# EAGLE design SNAC USB3-mini (EAGLE 7.7.0)
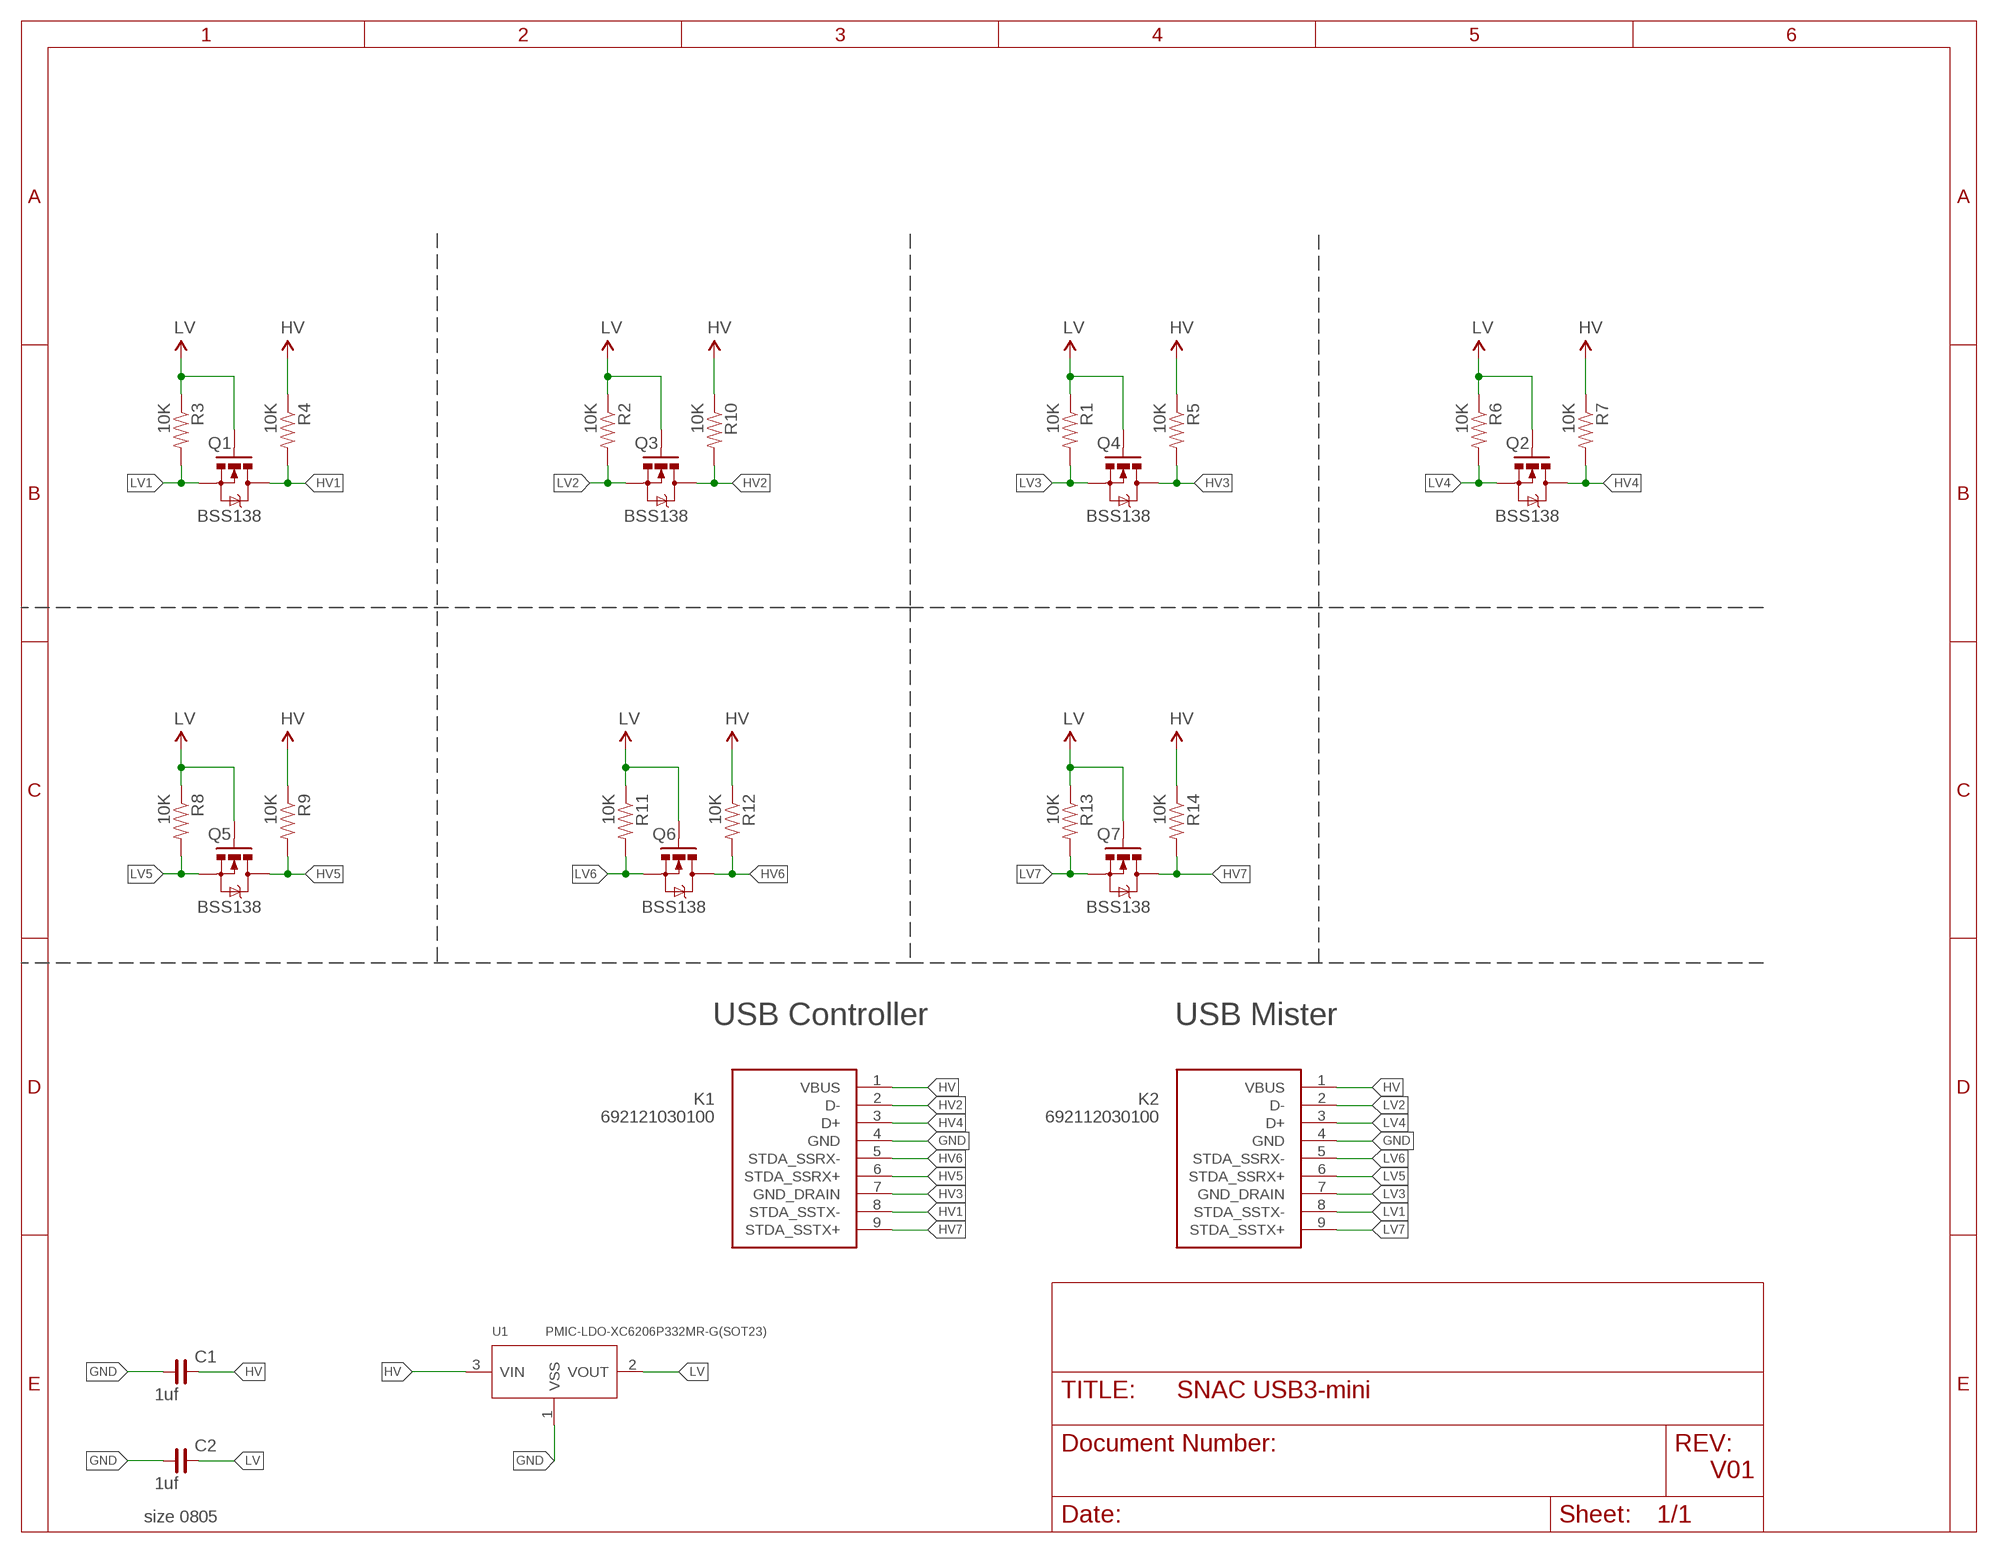
[diagram p0: schematic, sheet 1]

## Parts
C1  1uf  C_0805  [C0805]
C2  1uf  C_0805  [C0805]
K1  692121030100  [692121030100]
K2  692112030100  [692112030100]
Q1  BSS138  MOSFET-NCHANNELSMD  [SOT23-3]
Q2  BSS138  MOSFET-NCHANNELSMD  [SOT23-3]
Q3  BSS138  MOSFET-NCHANNELSMD  [SOT23-3]
Q4  BSS138  MOSFET-NCHANNELSMD  [SOT23-3]
Q5  BSS138  MOSFET-NCHANNELSMD  [SOT23-3]
Q6  BSS138  MOSFET-NCHANNELSMD  [SOT23-3]
Q7  BSS138  MOSFET-NCHANNELSMD  [SOT23-3]
R1  10K  RESISTOR0603-RES  [0603-RES]
R2  10K  RESISTOR0603-RES  [0603-RES]
R3  10K  RESISTOR0603-RES  [0603-RES]
R4  10K  RESISTOR0603-RES  [0603-RES]
R5  10K  RESISTOR0603-RES  [0603-RES]
R6  10K  RESISTOR0603-RES  [0603-RES]
R7  10K  RESISTOR0603-RES  [0603-RES]
R8  10K  RESISTOR0603-RES  [0603-RES]
R9  10K  RESISTOR0603-RES  [0603-RES]
R10  10K  RESISTOR0603-RES  [0603-RES]
R11  10K  RESISTOR0603-RES  [0603-RES]
R12  10K  RESISTOR0603-RES  [0603-RES]
R13  10K  RESISTOR0603-RES  [0603-RES]
R14  10K  RESISTOR0603-RES  [0603-RES]
U1  PMIC-LDO-XC6206P332MR-G(SOT23)  [SOT-23]

## Nets
GND: C1.1 C2.1 K1.4(GND) K2.4(GND) U1.1(VSS)
HV: C1.2 K1.1(VBUS) K2.1(VBUS) R4.1 R5.1 R7.1 R9.1 R10.1 R12.1 R14.1 U1.3(VIN)
HV1: K1.8(STDA_SSTX-) Q1.3(D) R4.2
HV2: K1.2(D-) Q3.3(D) R10.2
HV3: K1.7(GND_DRAIN) Q4.3(D) R5.2
HV4: K1.3(D+) Q2.3(D) R7.2
HV5: K1.6(STDA_SSRX+) Q5.3(D) R9.2
HV6: K1.5(STDA_SSRX-) Q6.3(D) R12.2
HV7: K1.9(STDA_SSTX+) Q7.3(D) R14.2
LV: C2.2 Q1.1(G) Q2.1(G) Q3.1(G) Q4.1(G) Q5.1(G) Q6.1(G) Q7.1(G) R1.1 R2.1 R3.1 R6.1 R8.1 R11.1 R13.1 U1.2(VOUT)
LV1: K2.8(STDA_SSTX-) Q1.2(S) R3.2
LV2: K2.2(D-) Q3.2(S) R2.2
LV3: K2.7(GND_DRAIN) Q4.2(S) R1.2
LV4: K2.3(D+) Q2.2(S) R6.2
LV5: K2.6(STDA_SSRX+) Q5.2(S) R8.2
LV6: K2.5(STDA_SSRX-) Q6.2(S) R11.2
LV7: K2.9(STDA_SSTX+) Q7.2(S) R13.2

## Notes on the sheet
- USB Controller | USB Mister
- V01
- size 0805

## Library data of the parts
C1 C2 = rc-master-smd:C_: NON-POLARIZED CAP
K1 = Wuerth_Elektronik_eiCan_Communication_Connectors_STENCIL:692121030100: WR-COM USB 3.0 HORIZONTAL TYPE A
K2 = Wuerth_Elektronik_eiCan_Communication_Connectors_STENCIL:692112030100: WR-COM USB 3.0 SMT PLUG WITH CLIPTYPE A
Q1-Q7 = SparkFun:MOSFET-NCHANNEL
R1-R14 = SparkFun:RESISTOR: Resistor Basic schematic elements and footprints for 0603, 1206, and PTH resistors.
U1 = PMIC-LDO-XC6206P332MR-G_SOT23_:PMIC-LDO-XC6206P332MR-G(SOT23): 310030099; AVAILABILITY: Unavailable; DESCRIPTION: SMD PMIC; LDO; Vin 6V; 3.3V; 200mA; Without En; 1-Ch; MF: Torex; MP: XC6206P332MR-G; PACKAGE: SOT-23-3 Torex; PRICE: None

## Board
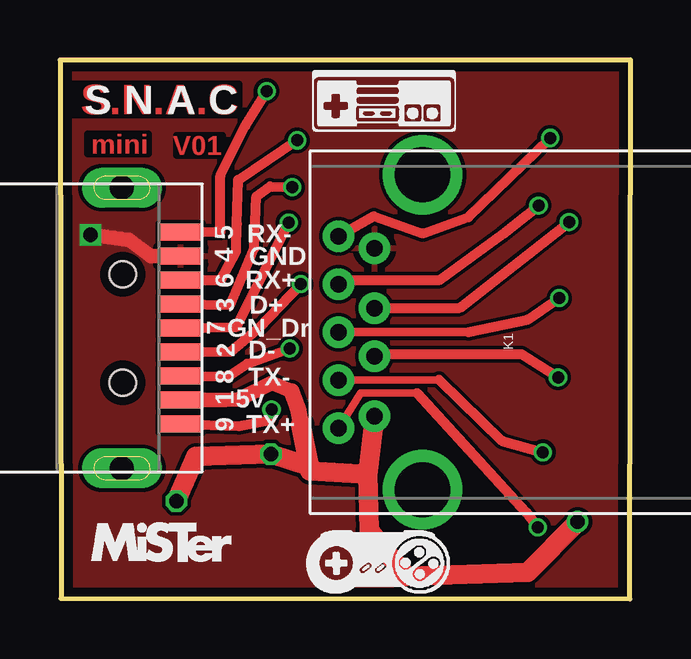
[diagram p1: board, top side]
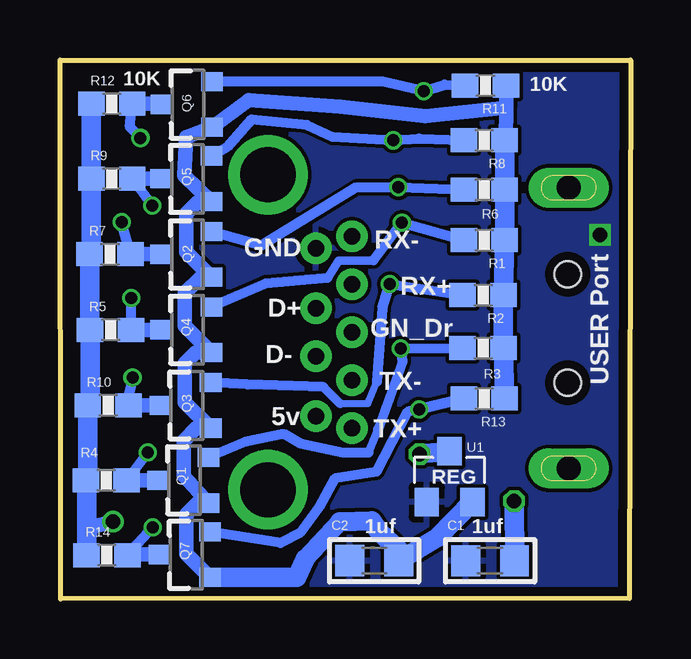
[diagram p2: board, bottom side, seen from below]

Size 23.77 x 22.48 mm. Coordinates in mm from the lower left corner, seen from the top.
Outline: 0.05,0.03 23.75,0 23.77,22.48 0,22.48 0.05,0.03
Copper layers (1*16): Top 0.035559375mm / dielectric 1.6mm / Bottom 0.035559375mm
Design rules "oshpark-2layer": minimum track width 6mil, minimum drill 10mil, track to track 6mil, track to pad 6mil, pad to pad 6mil, via to via 6mil, smd to smd 6mil, copper to edge 15mil, drill to drill 6mil, minimum pad ring 5mil, minimum via ring 5mil, stop-mask expansion 2.5mil, vias tented up to drill 0mil, thermal gap 10mil
Holes 1.1 mm at 2.62,13.54 2.62,9.02

### Footprints (pad centres in the part's own frame; a part is rotated, then mirrored left to right if it is on the bottom)
C0805 = smd 1.2 x 1.3: 1 -1.016,0; 2 1.016,0
692121030100 = drill 0.7 pad 1.3: 1 3.5,1.5; 2 1,1.5; 3 -1,1.5; 4 -3.5,1.5; 5 -4,0; 6 -2,0; 7 0,0; 8 2,0; 9 4,0 | drill 2.3 pad 3.3: Z1 -6.57,3.5; Z2 6.57,3.5
692112030100 = smd 0.7 x 1.8: 1 -3,0; 2 -1,0; 3 1,0; 4 3,0; 5 4,0; 6 2,0; 7 0,0; 8 -2,0; 9 -4,0 | drill 1 pad 1.676 long: Z1 5.85,2.45; Z2 -5.85,2.45
SOT23-3 = smd 0.8 x 0.9: 1 -0.95,-1; 2 0.95,-1; 3 0,1.1
0603-RES = smd 1.1 x 1: 1 -0.85,0; 2 0.85,0
SOT-23 = smd 1.016 x 1.2: 1 -0.95,-1.06; 2 0.95,-1.06; 3 0,1.06

### Placement (x,y rotation side)
C1  5.85,1.6 0 bottom
C2  10.68,1.6 0 bottom
K1  11.61,11.13 270 top
K2  5.03,11.3 90 top
Q1  18.59,4.95 90 bottom
Q2  18.47,14.38 90 bottom
Q3  18.49,8.08 90 bottom
Q4  18.47,11.23 90 bottom
Q5  18.47,17.53 90 bottom
Q6  18.44,20.62 90 bottom
Q7  18.52,1.85 90 bottom
R1  6.1,14.96 180 bottom
R2  6.15,12.67 180 bottom
R3  6.15,10.46 180 bottom
R4  21.85,4.95 0 bottom
R5  21.67,11.23 0 bottom
R6  6.1,17.07 180 bottom
R7  21.69,14.38 0 bottom
R8  6.1,19.13 180 bottom
R9  21.62,17.53 0 bottom
R10  21.77,8.08 0 bottom
R11  6.05,21.41 180 bottom
R12  21.62,20.65 0 bottom
R13  6.1,8.36 180 bottom
R14  21.82,1.83 0 bottom
U1  7.54,5.11 0 bottom

### Tracks (layer width: path | path; a pad name or v marks a point on that pad's centre or on a via)
GND  (via drill 0.6)
  Top 0.61: K2.4 3.78,14.3 2.9,14.96 v1.27,15.19
  Bottom 0.61: v1.27,15.19 1.27,15.16
  pour Top: -0.05,22.53 23.57,22.48 23.77,-0.05 0.05,0.03
  pour Bottom: -0.03,22.45 23.65,22.5 23.77,-0.05 0.03,0.03
HV  (via drill 0.6)
  Top 0.61: K2.1 6.88,8.31 7.42,8.33 8.81,9.02 9.64,8.67
  Top 0.66: 9.64,8.67 9.91,7.95 10.03,7.29
  Top 0.813: v21.56,3.23 19.48,1.12 14.43,0.94 12.88,2.87 12.81,5.2 | K1.1 12.81,5.2 | 12.81,5.2 10.41,5.33 10.38,5.54 | 10.03,7.29 10.38,5.54 | 10.38,5.54 v8.79,6.05 5.66,5.94 v4.85,4.09
  Bottom 0.61: 22.67,4.92 R4.1 | R14.1 22.68,1.82 22.48,3.01 v21.56,3.23
  Bottom 0.813: R14.1 22.67,4.92 | R4.1 22.62,5.03 R10.1 22.52,8.18 R5.1 22.54,11.25 R7.1 22.47,14.45 R9.1 R12.1 | C1.2 v4.85,4.09 | v8.79,6.05 U1.3
HV1  (via drill 0.5)
  Top 0.305: 11.74,9.14 15.8,9.14
  Top 0.406: K1.8 11.74,9.14 | 15.8,9.14 18.42,6.6 v20.12,6.12
  Bottom 0.406: R4.2 v20.12,6.12
  Bottom 0.61: Q1.3 R4.2
HV2  (via drill 0.5)
  Top 0.406: K1.2 13.19,10.21 19.23,10.21 v20.75,9.25
  Bottom 0.406: v20.75,9.25 20.92,8.52 R10.2
  Bottom 0.61: Q3.3 R10.2
HV3  (via drill 0.5)
  Top 0.356: K1.7 17.02,11.13
  Top 0.406: 17.02,11.13 19.51,11.66 v20.8,12.55
  Bottom 0.406: v20.8,12.55 20.82,12.46 R5.2
  Bottom 0.61: R5.2 Q4.3
HV4  (via drill 0.5)
  Top 0.406: K1.3 16.65,12.14 v21.21,15.72
  Bottom 0.406: v21.21,15.72 21.2,15.61 R7.2
  Bottom 0.61: Q2.3 R7.2
HV5  (via drill 0.5)
  Top 0.406: K1.6 11.79,13.31 15.82,13.31 18.44,15.21 v19.94,16.41
  Bottom 0.406: v19.94,16.41 20.75,17.53
  Bottom 0.61: Q5.3 20.75,17.53 R9.2
HV6  (via drill 0.5)
  Top 0.406: K1.5 13.08,15.96 15.11,15.24 17.02,15.93 v20.42,19.23
  Bottom 0.406: v20.42,19.23 20.87,19.67 R12.2
  Bottom 0.61: Q6.3 19.57,20.65 R12.2
HV7  (via drill 0.5)
  Top 0.305: K1.9 12.54,8.59 14.88,8.59
  Top 0.406: 14.88,8.59 19.41,3.63 v19.91,3
  Bottom 0.406: 20.94,1.85 R14.2 v19.91,3
  Bottom 0.61: Q7.3 20.94,1.85
LV
  Bottom 0.61: 9.66,2.04 C2.2 | Q7.1 17.54,0.9 18.52,1.88 18.52,3.53 18.04,4 Q1.1 18.62,5.13 18.62,6.6 18.1,7.13 Q3.1 18.57,8.2 18.57,9.83 18.12,10.28 Q4.1 18.57,11.38 18.57,12.75 17.89,13.43 Q2.1 18.52,14.48 18.52,16.08 18.04,16.55 Q5.1 18.59,17.65 18.52,19.25 Q6.1 15.9,20.8 12.09,20.52 8.56,20.14 5.18,20.5 | R8.1 5.2,19.15 5.18,20.5 | R11.1 5.18,20.5
  Bottom 0.762: 12.12,3.23 13.56,1.68
  Bottom 0.813: R8.1 R6.1 R1.1 R2.1 R3.1 R13.1 | C2.2 8.04,2.57 U1.2 | 9.66,2.04 10.47,2.79 10.8,3.25 12.12,3.23 | 13.56,1.68 13.92,0.91 Q7.1
LV1  (via drill 0.5)
  Top 0.406: K2.8 7.01,9.27 7.8,9.8 v9.58,10.44
  Bottom 0.356: 10.52,7.09 10.92,6.1
  Bottom 0.406: 10.52,7.09 9.5,9.93 v9.58,10.44 R3.2 | Q1.2 16.05,6.55 14.45,6.88 13.74,6.48 11.99,6.1 10.92,6.1
LV2  (via drill 0.5)
  Top 0.406: K2.2 7.11,10.31 8.31,11.33 v10.03,13.13
  Bottom 0.305: 10.57,9.07 10.95,8.15 12.09,8.13
  Bottom 0.356: 12.09,8.13 12.8,8.84
  Bottom 0.406: 10.57,9.07 10.34,12.12 v10.03,13.13 R2.2 | 12.8,8.84 15.95,8.94 Q3.2
LV3  (via drill 0.5)
  Top 0.406: K2.7 7.37,11.35 v9.53,15.7
  Bottom 0.356: 12.62,13.39 12.17,14.12 10.72,14.12
  Bottom 0.406: 12.62,13.39 15.19,13.16 Q4.2 | R1.2 v9.53,15.7 10.72,14.12
LV4  (via drill 0.5)
  Top 0.406: K2.3 7.09,12.27 8.1,14.63 8.18,16.79 8.74,17.2 v9.68,17.17
  Bottom 0.406: Q2.2 15.39,14.73 11.4,17.17 v9.68,17.17 R6.2
LV5  (via drill 0.5)
  Top 0.406: K2.6 6.64,13.3 6.68,13.26 7.34,14.5 7.37,15.65 7.42,17.48 v9.88,19.13
  Bottom 0.406: Q5.2 16.82,18.85 15.8,19.99 13.47,19.76 12.42,19.28 v9.88,19.13 8.81,19.2 R8.2
LV6  (via drill 0.5)
  Top 0.406: K2.5 6.68,15.32 6.68,17.65 7.72,19.74 v8.61,21.18
  Bottom 0.406: Q6.2 10.33,21.57 v8.61,21.18 7.75,21.45 R11.2
LV7  (via drill 0.5)
  Top 0.406: K2.9 7.47,7.21 8.76,7.47 v8.81,7.9
  Bottom 0.406: Q7.2 14.58,2.34 13.77,2.77 12.98,3.84 12.32,5.03 10.59,5.31 9.3,7.8 R13.2 v8.81,7.9

### Text on the board
Top: S.N.A.C | mini | V01
tPlace: S | N | A | C | 5 | RX- | 4 | GND | 6 | RX+ | 3 | D+ | 7 | GN_Dr | 2 | D- | 8 | TX- | 1 | 5v | 9 | TX+
bPlace: 10K | 10K | RX- | GND | USER Port | RX+ | GN_Dr | D+ | D- | TX- | 5v | TX+ | REG | 1uf | 1uf
tValues: + | -